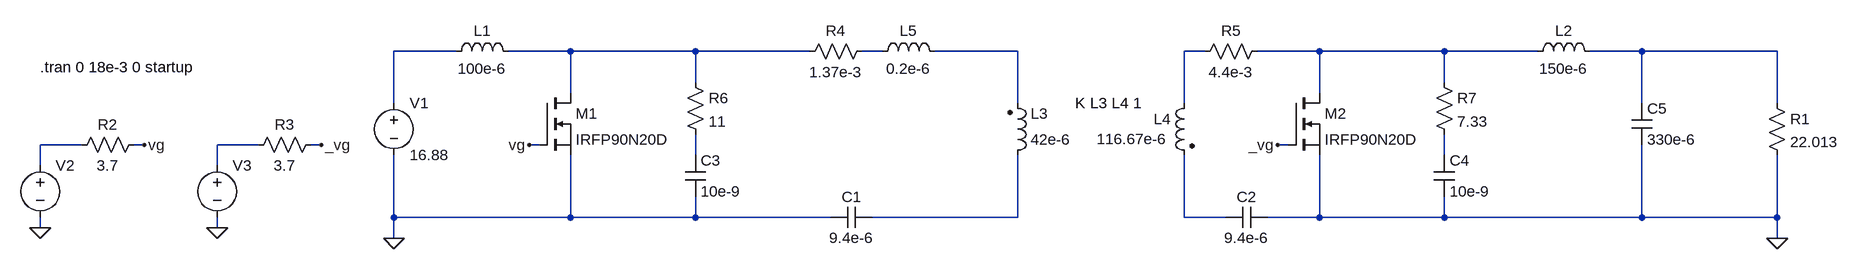
[diagram p0: schematic cuk-iso-prototype.asc]
cuk-iso-prototype.asc, the LTspice schematic file:
Version 4
SHEET 1 2248 680
WIRE -256 -240 -352 -240
WIRE -80 -240 -176 -240
WIRE 112 -240 -80 -240
WIRE 288 -240 112 -240
WIRE 400 -240 368 -240
WIRE 608 -240 480 -240
WIRE 896 -240 864 -240
WIRE 1072 -240 976 -240
WIRE 1264 -240 1072 -240
WIRE 1408 -240 1264 -240
WIRE 1568 -240 1488 -240
WIRE 1776 -240 1568 -240
WIRE 112 -192 112 -240
WIRE 1264 -192 1264 -240
WIRE -80 -176 -80 -240
WIRE 1072 -176 1072 -240
WIRE -352 -160 -352 -240
WIRE 608 -160 608 -240
WIRE 864 -160 864 -240
WIRE 1568 -160 1568 -240
WIRE 1776 -160 1776 -240
WIRE -832 -96 -896 -96
WIRE -736 -96 -752 -96
WIRE -560 -96 -624 -96
WIRE -464 -96 -480 -96
WIRE -128 -96 -144 -96
WIRE 1024 -96 1008 -96
WIRE 112 -80 112 -112
WIRE 1264 -80 1264 -112
WIRE -896 -64 -896 -96
WIRE -624 -64 -624 -96
WIRE -352 16 -352 -80
WIRE -80 16 -80 -80
WIRE -80 16 -352 16
WIRE 112 16 112 -16
WIRE 112 16 -80 16
WIRE 320 16 112 16
WIRE 608 16 608 -80
WIRE 608 16 384 16
WIRE 864 16 864 -80
WIRE 928 16 864 16
WIRE 1072 16 1072 -80
WIRE 1072 16 992 16
WIRE 1264 16 1264 -16
WIRE 1264 16 1072 16
WIRE 1568 16 1568 -96
WIRE 1568 16 1264 16
WIRE 1776 16 1776 -80
WIRE 1776 16 1568 16
WIRE -896 32 -896 16
WIRE -624 32 -624 16
WIRE -352 48 -352 16
WIRE 1776 48 1776 16
FLAG -352 48 0
FLAG -896 32 0
FLAG -736 -96 vg
FLAG -144 -96 vg
FLAG -624 32 0
FLAG -464 -96 _vg
FLAG 1008 -96 _vg
FLAG 1776 48 0
SYMBOL voltage -352 -176 R0
WINDOW 123 0 0 Left 0
WINDOW 39 0 0 Left 0
SYMATTR InstName V1
SYMATTR Value 16.88
SYMBOL cap 384 0 R90
WINDOW 0 0 32 VBottom 2
WINDOW 3 32 32 VTop 2
SYMATTR InstName C1
SYMATTR Value 9.4e-6
SYMATTR SpiceLine Rser=2.5e-3
SYMBOL res 1760 -176 R0
SYMATTR InstName R1
SYMATTR Value 22.013
SYMBOL nmos -128 -176 R0
SYMATTR InstName M1
SYMATTR Value IRFP90N20D
SYMBOL ind -272 -224 R270
WINDOW 0 32 56 VTop 2
WINDOW 3 5 56 VBottom 2
SYMATTR InstName L1
SYMATTR Value 100e-6
SYMATTR SpiceLine Rser=42.43e-3
SYMBOL voltage -896 -80 R0
WINDOW 3 24 96 Invisible 2
WINDOW 123 0 0 Left 0
WINDOW 39 0 0 Left 0
SYMATTR Value PULSE(0 12 0 10e-9 10e-9 5.0e-06 10e-6)
SYMATTR InstName V2
SYMBOL res -736 -112 R90
WINDOW 0 0 56 VBottom 2
WINDOW 3 32 56 VTop 2
SYMATTR InstName R2
SYMATTR Value 3.7
SYMBOL ind2 592 -64 M180
WINDOW 0 36 80 Left 2
WINDOW 3 36 40 Left 2
SYMATTR InstName L3
SYMATTR Value 42e-6
SYMATTR Type ind
SYMBOL ind2 880 -176 M0
WINDOW 3 41 71 Left 2
SYMATTR Value 116.67e-6
SYMATTR InstName L4
SYMATTR Type ind
SYMBOL voltage -624 -80 R0
WINDOW 3 24 96 Invisible 2
WINDOW 123 0 0 Left 0
WINDOW 39 0 0 Left 0
SYMATTR Value PULSE(12 0 9.800e-6 10e-9 10e-9 5.40e-06 10e-6)
SYMATTR InstName V3
SYMBOL res -464 -112 R90
WINDOW 0 0 56 VBottom 2
WINDOW 3 32 56 VTop 2
SYMATTR InstName R3
SYMATTR Value 3.7
SYMBOL nmos 1024 -176 R0
SYMATTR InstName M2
SYMATTR Value IRFP90N20D
SYMBOL ind 1392 -224 R270
WINDOW 0 32 56 VTop 2
WINDOW 3 5 56 VBottom 2
SYMATTR InstName L2
SYMATTR Value 150e-6
SYMATTR SpiceLine Rser=10.26e-3
SYMBOL cap 1552 -160 R0
SYMATTR InstName C5
SYMATTR Value 330e-6
SYMATTR SpiceLine Rser=0.131
SYMBOL cap 992 0 R90
WINDOW 0 0 32 VBottom 2
WINDOW 3 32 32 VTop 2
SYMATTR InstName C2
SYMATTR Value 9.4e-6
SYMATTR SpiceLine Rser=2.5e-3
SYMBOL ind 384 -224 R270
WINDOW 0 32 56 VTop 2
WINDOW 3 5 56 VBottom 2
SYMATTR InstName L5
SYMATTR Value 0.2e-6
SYMATTR SpiceLine Rser=6.38e-3
SYMBOL res 384 -256 R90
WINDOW 0 0 56 VBottom 2
WINDOW 3 32 56 VTop 2
SYMATTR InstName R4
SYMATTR Value 1.37e-3
SYMBOL res 992 -256 R90
WINDOW 0 0 56 VBottom 2
WINDOW 3 32 56 VTop 2
SYMATTR InstName R5
SYMATTR Value 4.4e-3
SYMBOL res 96 -208 R0
SYMATTR InstName R6
SYMATTR Value 11
SYMBOL cap 96 -80 R0
SYMATTR InstName C3
SYMATTR Value 10e-9
SYMBOL res 1248 -208 R0
SYMATTR InstName R7
SYMATTR Value 7.33
SYMBOL cap 1248 -80 R0
SYMATTR InstName C4
SYMATTR Value 10e-9
TEXT -896 -216 Left 2 !.tran 0 18e-3 0 startup
TEXT 696 -160 Left 2 !K L3 L4 1

The netlist it stands for:
* cuk-iso-prototype.asc
V1 N001 0 16.88
C1 N012 0 9.4e-6 Rser=2.5e-3
R1 N007 0 22.013
M1 N002 vg 0 0 IRFP90N20D
L1 N001 N002 100e-6 Rser=42.43e-3
V2 N008 0 PULSE(0 12 0 10e-9 10e-9 5.0e-06 10e-6)
R2 vg N008 3.7
L3 N012 N004 42e-6
L4 N005 N013 116.67e-6
V3 N009 0 PULSE(12 0 9.800e-6 10e-9 10e-9 5.40e-06 10e-6)
R3 _vg N009 3.7
M2 N006 _vg 0 0 IRFP90N20D
L2 N006 N007 150e-6 Rser=10.26e-3
C5 N007 0 330e-6 Rser=0.131
C2 0 N013 9.4e-6 Rser=2.5e-3
L5 N003 N004 0.2e-6 Rser=6.38e-3
R4 N003 N002 1.37e-3
R5 N006 N005 4.4e-3
R6 N002 N010 11
C3 N010 0 10e-9
R7 N006 N011 7.33
C4 N011 0 10e-9
.model NMOS NMOS
.model PMOS PMOS
.lib standard.mos
.tran 0 18e-3 0 startup
K L3 L4 1
.backanno
.end